# EAGLE schematic IOMOD-AD5593R-v2_0 (EAGLE 9.7.0)
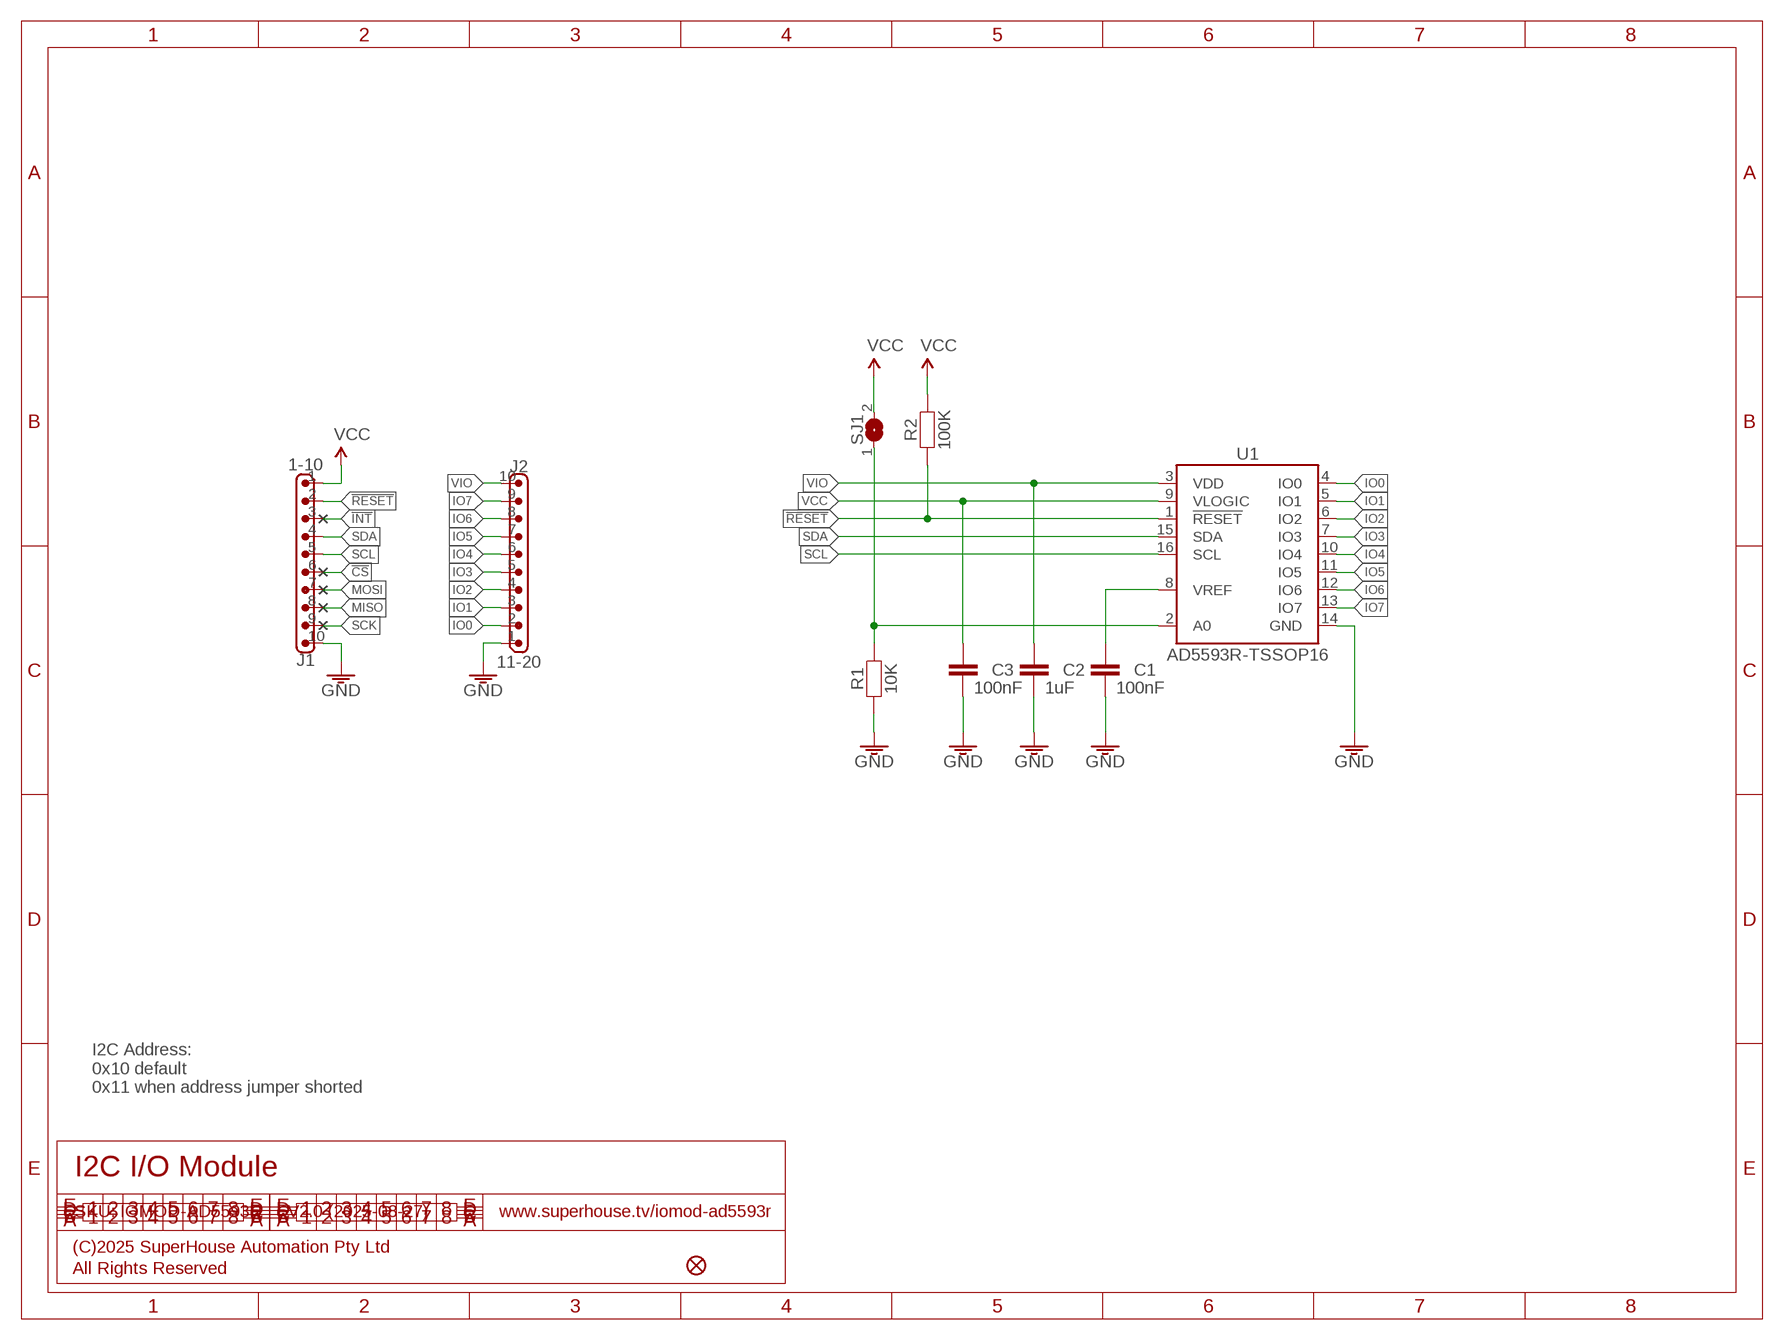
[diagram p0: schematic, sheet 1]

## Parts
C1  100nF  CAP0603  [C0603]
C2  1uF  CAP0603  [C0603]
C3  100nF  CAP0603  [C0603]
FID1  FIDUCIAL1X2.5  [FIDUCIAL-1X2.5]
J1  1-10  M10-2.00-P-ABOVE  [1X10-2.00-P-ABOVE]
J2  11-20  M10-2.00-P-ABOVE  [1X10-2.00-P-ABOVE]
R1  10K  RESISTOR0603  [R0603]
R2  100K  RESISTOR0603  [R0603]
SJ1  SJ-NORMAL  [SJ]
U1  AD5593R-TSSOP16  [TSSOP16]

## Nets
!CS: J1.6
!INT: J1.3
!RESET: J1.2 R2.1 U1.1(!RESET)
GND: C1.2 C2.2 C3.2 J1.10 J2.1 R1.1 U1.14(GND)
IO0: J2.2 U1.4(IO0)
IO1: J2.3 U1.5(IO1)
IO2: J2.4 U1.6(IO2)
IO3: J2.5 U1.7(IO3)
IO4: J2.6 U1.10(IO4)
IO5: J2.7 U1.11(IO5)
IO6: J2.8 U1.12(IO6)
IO7: J2.9 U1.13(IO7)
MISO: J1.8
MOSI: J1.7
N$1: R1.2 SJ1.1 U1.2(A0)
N$3: C1.1 U1.8(VREF)
SCK: J1.9
SCL: J1.5 U1.16(SCL)
SDA: J1.4 U1.15(SDA)
VCC: C3.1 J1.1 R2.2 SJ1.2 U1.9(VLOGIC)
VIO: C2.1 J2.10 U1.3(VDD)

## Notes on the sheet
- I2C Address:
  0x10 default
  0x11 when address jumper shorted
- I2C I/O Module
- SKU: IOMOD-AD5593R | V2.0 (2025-08-27) | www.superhouse.tv/iomod-ad5593r
- (C)2025 SuperHouse Automation Pty Ltd
- All Rights Reserved

## Library data of the parts
C1-C3 = SuperHouse-Capacitors:CAP: Capacitor Standard ceramic capacitor
FID1 = SuperHouse-Symbols:FIDUCIAL: Fiducial Alignment Points Various fiducial points for machine vision alignment.
J1 J2 = SuperHouse-Connectors:M10: 10-way header Standard 1x10 header, and screw terminal variations
R1 R2 = SuperHouse-Resistors:RESISTOR: Resistors in both surface-mount and through-hole versions.
SJ1 = SuperHouse-Jumpers:SJ: SMD solder jumper, normally-open. Add solder to close the connection.
U1 = SuperHouse-ICs:AD5593R

## Net classes
0 Default: width 0.203 mm
1 VCC: width 0.305 mm